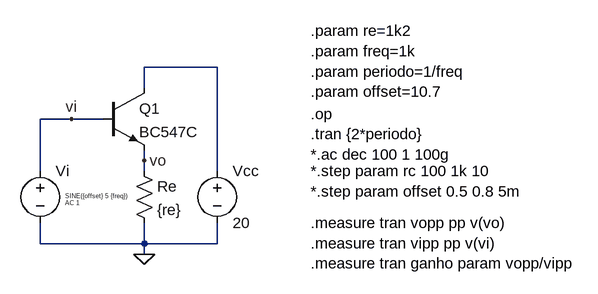
[diagram p0: schematic common_colector_npn_ex1.asc]
common_colector_npn_ex1.asc, the LTspice schematic file:
Version 4
SHEET 1 960 680
WIRE 288 32 176 32
WIRE 176 64 176 32
WIRE 64 112 16 112
WIRE 112 112 64 112
WIRE 176 176 176 160
WIRE 16 192 16 112
WIRE 176 192 176 176
WIRE 288 192 288 32
WIRE 16 304 16 272
WIRE 176 304 176 272
WIRE 176 304 16 304
WIRE 288 304 288 272
WIRE 288 304 176 304
WIRE 176 320 176 304
FLAG 176 320 0
FLAG 176 176 vo
FLAG 64 112 vi
SYMBOL npn 112 64 R0
SYMATTR InstName Q1
SYMATTR Value BC547C
SYMBOL voltage 16 176 R0
WINDOW 3 38 54 Left 0
WINDOW 123 38 65 Left 0
WINDOW 39 0 0 Left 0
SYMATTR Value SINE({offset} 5 {freq})
SYMATTR Value2 AC 1
SYMATTR InstName Vi
SYMBOL res 160 176 R0
SYMATTR InstName Re
SYMATTR Value {re}
SYMBOL voltage 288 176 R0
WINDOW 123 0 0 Left 0
WINDOW 39 0 0 Left 0
SYMATTR InstName Vcc
SYMATTR Value 20
TEXT 432 -24 Left 2 !.param re=1k2\n.param freq=1k\n.param periodo=1/freq\n.param offset=10.7
TEXT 432 104 Left 2 !.op\n.tran {2*periodo}\n*.ac dec 100 1 100g
TEXT 432 272 Left 2 !.measure tran vopp pp v(vo)\n.measure tran vipp pp v(vi)\n.measure tran ganho param vopp/vipp
TEXT 432 192 Left 2 !*.step param rc 100 1k 10\n*.step param offset 0.5 0.8 5m

The netlist it stands for:
* common_colector_npn_ex1.asc
Q1 N001 vi vo 0 BC547C
Vi vi 0 SINE({offset} 5 {freq}) AC 1
Re vo 0 {re}
Vcc N001 0 20
.model NPN NPN
.model PNP PNP
.lib standard.bjt
.param re=1k2
.param freq=1k
.param periodo=1/freq
.param offset=10.7
.op
.tran {2*periodo}
*.ac dec 100 1 100g
.measure tran vopp pp v(vo)
.measure tran vipp pp v(vi)
.measure tran ganho param vopp/vipp
*.step param rc 100 1k 10
*.step param offset 0.5 0.8 5m
.backanno
.end